# Altium schematic sheet mini_backplane.SchDoc
size A3
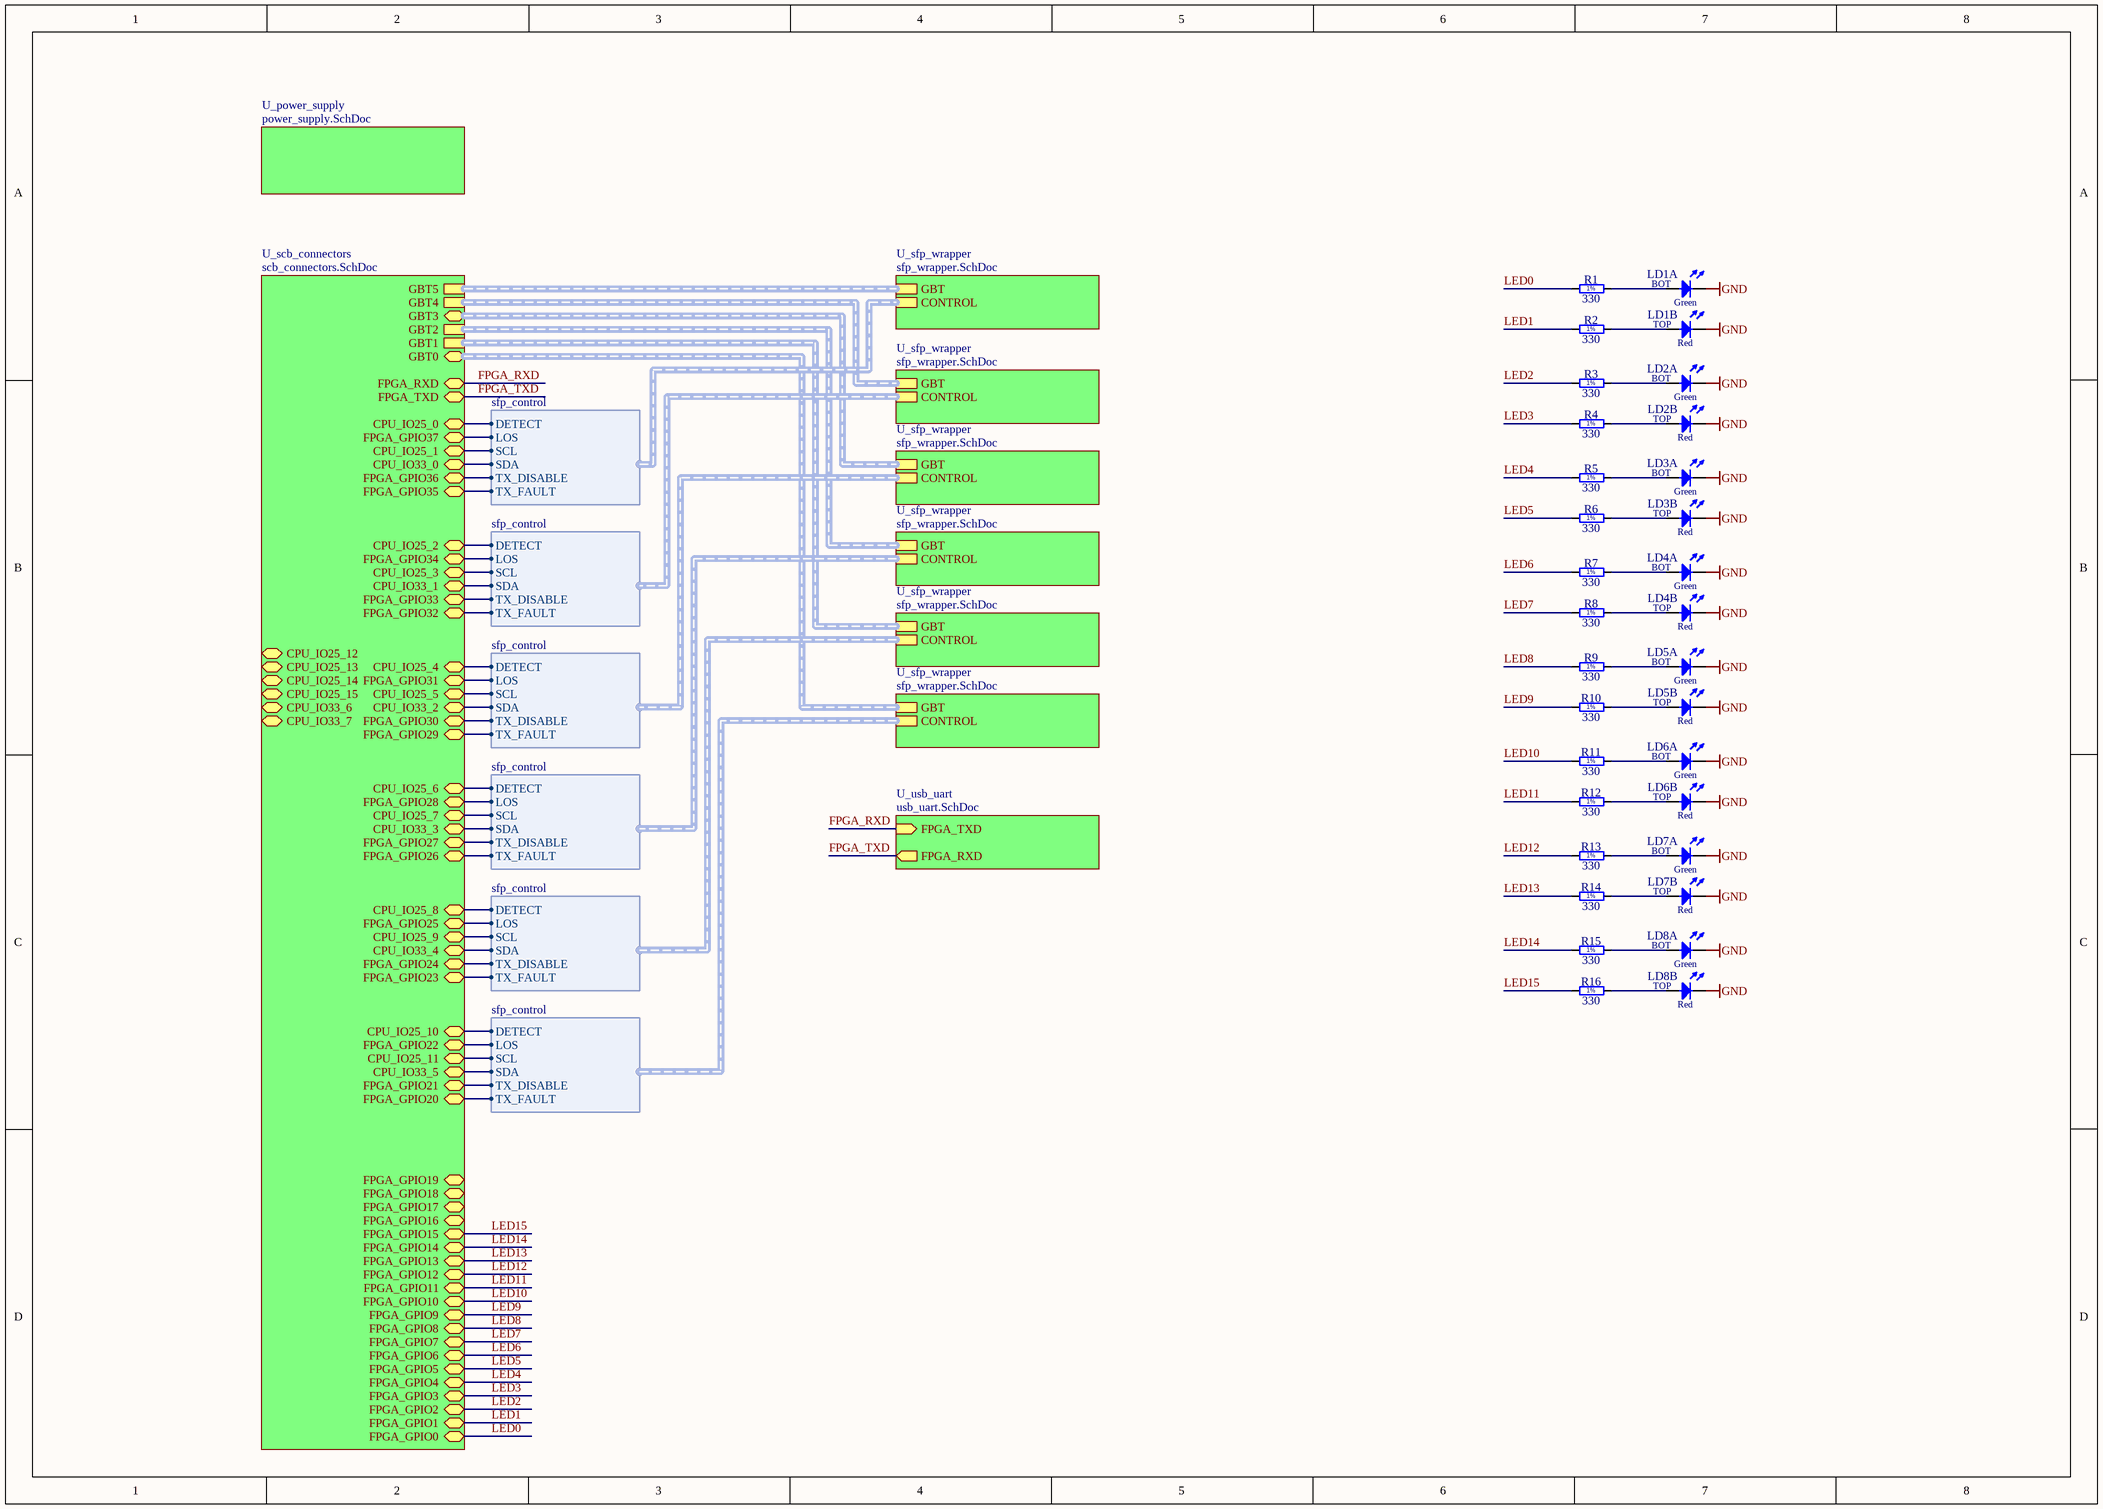
[diagram p0: mini_backplane.SchDoc]

## Parts
LD1  Red/Green  [LED_DIALIGHT_571-0112-100F]  (value not drawn)  (parts A,B of 2)
LD2  Red/Green  [LED_DIALIGHT_571-0112-100F]  (value not drawn)  (parts A,B of 2)
LD3  Red/Green  [LED_DIALIGHT_571-0112-100F]  (value not drawn)  (parts A,B of 2)
LD4  Red/Green  [LED_DIALIGHT_571-0112-100F]  (value not drawn)  (parts A,B of 2)
LD5  Red/Green  [LED_DIALIGHT_571-0112-100F]  (value not drawn)  (parts A,B of 2)
LD6  Red/Green  [LED_DIALIGHT_571-0112-100F]  (value not drawn)  (parts A,B of 2)
LD7  Red/Green  [LED_DIALIGHT_571-0112-100F]  (value not drawn)  (parts A,B of 2)
LD8  Red/Green  [LED_DIALIGHT_571-0112-100F]  (value not drawn)  (parts A,B of 2)
R1  330  [RESC1608X55N]
R2  330  [RESC1608X55N]
R3  330  [RESC1608X55N]
R4  330  [RESC1608X55N]
R5  330  [RESC1608X55N]
R6  330  [RESC1608X55N]
R7  330  [RESC1608X55N]
R8  330  [RESC1608X55N]
R9  330  [RESC1608X55N]
R10  330  [RESC1608X55N]
R11  330  [RESC1608X55N]
R12  330  [RESC1608X55N]
R13  330  [RESC1608X55N]
R14  330  [RESC1608X55N]
R15  330  [RESC1608X55N]
R16  330  [RESC1608X55N]

## Sub-sheets
U_power_supply = power_supply.SchDoc: no entries
U_scb_connectors = scb_connectors.SchDoc: FPGA_GPIO0 (bidir), FPGA_GPIO1 (bidir), FPGA_GPIO2 (bidir), FPGA_GPIO3 (bidir), FPGA_GPIO4 (bidir), FPGA_GPIO5 (bidir), FPGA_GPIO6 (bidir), FPGA_GPIO7 (bidir), FPGA_GPIO8 (bidir), FPGA_GPIO9 (bidir), FPGA_GPIO10 (bidir), FPGA_GPIO11 (bidir), FPGA_GPIO12 (bidir), FPGA_GPIO13 (bidir), FPGA_GPIO14 (bidir), FPGA_GPIO15 (bidir), FPGA_GPIO16 (bidir), FPGA_GPIO17 (bidir), FPGA_GPIO18 (bidir), FPGA_GPIO19 (bidir), FPGA_GPIO20 (bidir), FPGA_GPIO21 (bidir), FPGA_GPIO22 (bidir), FPGA_GPIO23 (bidir), FPGA_GPIO24 (bidir), FPGA_GPIO25 (bidir), FPGA_GPIO26 (bidir), FPGA_GPIO27 (bidir), FPGA_GPIO28 (bidir), FPGA_GPIO29 (bidir), FPGA_GPIO30 (bidir), FPGA_GPIO31 (bidir), FPGA_GPIO32 (bidir), FPGA_GPIO33 (bidir), FPGA_GPIO34 (bidir), FPGA_GPIO35 (bidir), FPGA_GPIO36 (bidir), FPGA_GPIO37 (bidir), GBT1 (harness sfp_gbit), GBT2 (harness sfp_gbit), GBT4 (harness sfp_gbit), GBT5 (harness sfp_gbit), FPGA_RXD (bidir), FPGA_TXD (bidir), GBT0 (harness sfp_gbit), GBT3 (harness sfp_gbit), CPU_IO25_0 (bidir), CPU_IO25_1 (bidir), CPU_IO25_2 (bidir), CPU_IO25_3 (bidir), CPU_IO25_4 (bidir), CPU_IO25_5 (bidir), CPU_IO25_6 (bidir), CPU_IO25_7 (bidir), CPU_IO25_8 (bidir), CPU_IO25_9 (bidir), CPU_IO25_10 (bidir), CPU_IO25_11 (bidir), CPU_IO25_12 (bidir), CPU_IO25_13 (bidir), CPU_IO25_14 (bidir), CPU_IO25_15 (bidir), CPU_IO33_0 (bidir), CPU_IO33_1 (bidir), CPU_IO33_2 (bidir), CPU_IO33_3 (bidir), CPU_IO33_4 (bidir), CPU_IO33_5 (bidir), CPU_IO33_6 (bidir), CPU_IO33_7 (bidir)
U_sfp_wrapper = sfp_wrapper.SchDoc: GBT (harness sfp_gbit), CONTROL (harness sfp_control)
U_sfp_wrapper = sfp_wrapper.SchDoc: GBT (harness sfp_gbit), CONTROL (harness sfp_control)
U_sfp_wrapper = sfp_wrapper.SchDoc: GBT (harness sfp_gbit), CONTROL (harness sfp_control)
U_sfp_wrapper = sfp_wrapper.SchDoc: GBT (harness sfp_gbit), CONTROL (harness sfp_control)
U_sfp_wrapper = sfp_wrapper.SchDoc: GBT (harness sfp_gbit), CONTROL (harness sfp_control)
U_sfp_wrapper = sfp_wrapper.SchDoc: GBT (harness sfp_gbit), CONTROL (harness sfp_control)
U_usb_uart = usb_uart.SchDoc: FPGA_RXD (out), FPGA_TXD (in)

## Harnesses
sfp_control: DETECT, LOS, SCL, SDA, TX_DISABLE, TX_FAULT

## Nets
GND: LD1.1(C) LD1.3(C) LD2.1(C) LD2.3(C) LD3.1(C) LD3.3(C) LD4.1(C) LD4.3(C) LD5.1(C) LD5.3(C) LD6.1(C) LD6.3(C) LD7.1(C) LD7.3(C) LD8.1(C) LD8.3(C)
FPGA_RXD: sheet U_scb_connectors/FPGA_RXD, sheet U_usb_uart/FPGA_TXD
FPGA_TXD: sheet U_scb_connectors/FPGA_TXD, sheet U_usb_uart/FPGA_RXD
LED0: R1.1 ; sheet U_scb_connectors/FPGA_GPIO0
LED1: R2.1 ; sheet U_scb_connectors/FPGA_GPIO1
LED2: R3.1 ; sheet U_scb_connectors/FPGA_GPIO2
LED3: R4.1 ; sheet U_scb_connectors/FPGA_GPIO3
LED4: R5.1 ; sheet U_scb_connectors/FPGA_GPIO4
LED5: R6.1 ; sheet U_scb_connectors/FPGA_GPIO5
LED6: R7.1 ; sheet U_scb_connectors/FPGA_GPIO6
LED7: R8.1 ; sheet U_scb_connectors/FPGA_GPIO7
LED8: R9.1 ; sheet U_scb_connectors/FPGA_GPIO8
LED9: R10.1 ; sheet U_scb_connectors/FPGA_GPIO9
LED10: R11.1 ; sheet U_scb_connectors/FPGA_GPIO10
LED11: R12.1 ; sheet U_scb_connectors/FPGA_GPIO11
LED12: R13.1 ; sheet U_scb_connectors/FPGA_GPIO12
LED13: R14.1 ; sheet U_scb_connectors/FPGA_GPIO13
LED14: R15.1 ; sheet U_scb_connectors/FPGA_GPIO14
LED15: R16.1 ; sheet U_scb_connectors/FPGA_GPIO15
NetLD1_2: LD1.2(A) R1.2
NetLD1_4: LD1.4(A) R2.2
NetLD2_2: LD2.2(A) R3.2
NetLD2_4: LD2.4(A) R4.2
NetLD3_2: LD3.2(A) R5.2
NetLD3_4: LD3.4(A) R6.2
NetLD4_2: LD4.2(A) R7.2
NetLD4_4: LD4.4(A) R8.2
NetLD5_2: LD5.2(A) R9.2
NetLD5_4: LD5.4(A) R10.2
NetLD6_2: LD6.2(A) R11.2
NetLD6_4: LD6.4(A) R12.2
NetLD7_2: LD7.2(A) R13.2
NetLD7_4: LD7.4(A) R14.2
NetLD8_2: LD8.2(A) R15.2
NetLD8_4: LD8.4(A) R16.2
(unnamed): sheet U_scb_connectors/FPGA_GPIO20, sheet U_sfp_wrapper/CONTROL.TX_FAULT
(unnamed): sheet U_scb_connectors/FPGA_GPIO21, sheet U_sfp_wrapper/CONTROL.TX_DISABLE
(unnamed): sheet U_scb_connectors/FPGA_GPIO22, sheet U_sfp_wrapper/CONTROL.LOS
(unnamed): sheet U_scb_connectors/FPGA_GPIO23, sheet U_sfp_wrapper/CONTROL.TX_FAULT
(unnamed): sheet U_scb_connectors/FPGA_GPIO24, sheet U_sfp_wrapper/CONTROL.TX_DISABLE
(unnamed): sheet U_scb_connectors/FPGA_GPIO25, sheet U_sfp_wrapper/CONTROL.LOS
(unnamed): sheet U_scb_connectors/FPGA_GPIO26, sheet U_sfp_wrapper/CONTROL.TX_FAULT
(unnamed): sheet U_scb_connectors/FPGA_GPIO27, sheet U_sfp_wrapper/CONTROL.TX_DISABLE
(unnamed): sheet U_scb_connectors/FPGA_GPIO28, sheet U_sfp_wrapper/CONTROL.LOS
(unnamed): sheet U_scb_connectors/FPGA_GPIO29, sheet U_sfp_wrapper/CONTROL.TX_FAULT
(unnamed): sheet U_scb_connectors/FPGA_GPIO30, sheet U_sfp_wrapper/CONTROL.TX_DISABLE
(unnamed): sheet U_scb_connectors/FPGA_GPIO31, sheet U_sfp_wrapper/CONTROL.LOS
(unnamed): sheet U_scb_connectors/FPGA_GPIO32, sheet U_sfp_wrapper/CONTROL.TX_FAULT
(unnamed): sheet U_scb_connectors/FPGA_GPIO33, sheet U_sfp_wrapper/CONTROL.TX_DISABLE
(unnamed): sheet U_scb_connectors/FPGA_GPIO34, sheet U_sfp_wrapper/CONTROL.LOS
(unnamed): sheet U_scb_connectors/FPGA_GPIO35, sheet U_sfp_wrapper/CONTROL.TX_FAULT
(unnamed): sheet U_scb_connectors/FPGA_GPIO36, sheet U_sfp_wrapper/CONTROL.TX_DISABLE
(unnamed): sheet U_scb_connectors/FPGA_GPIO37, sheet U_sfp_wrapper/CONTROL.LOS
(unnamed): sheet U_scb_connectors/CPU_IO25_0, sheet U_sfp_wrapper/CONTROL.DETECT
(unnamed): sheet U_scb_connectors/CPU_IO25_1, sheet U_sfp_wrapper/CONTROL.SCL
(unnamed): sheet U_scb_connectors/CPU_IO25_2, sheet U_sfp_wrapper/CONTROL.DETECT
(unnamed): sheet U_scb_connectors/CPU_IO25_3, sheet U_sfp_wrapper/CONTROL.SCL
(unnamed): sheet U_scb_connectors/CPU_IO25_4, sheet U_sfp_wrapper/CONTROL.DETECT
(unnamed): sheet U_scb_connectors/CPU_IO25_5, sheet U_sfp_wrapper/CONTROL.SCL
(unnamed): sheet U_scb_connectors/CPU_IO25_6, sheet U_sfp_wrapper/CONTROL.DETECT
(unnamed): sheet U_scb_connectors/CPU_IO25_7, sheet U_sfp_wrapper/CONTROL.SCL
(unnamed): sheet U_scb_connectors/CPU_IO25_8, sheet U_sfp_wrapper/CONTROL.DETECT
(unnamed): sheet U_scb_connectors/CPU_IO25_9, sheet U_sfp_wrapper/CONTROL.SCL
(unnamed): sheet U_scb_connectors/CPU_IO25_10, sheet U_sfp_wrapper/CONTROL.DETECT
(unnamed): sheet U_scb_connectors/CPU_IO25_11, sheet U_sfp_wrapper/CONTROL.SCL
(unnamed): sheet U_scb_connectors/CPU_IO33_0, sheet U_sfp_wrapper/CONTROL.SDA
(unnamed): sheet U_scb_connectors/CPU_IO33_1, sheet U_sfp_wrapper/CONTROL.SDA
(unnamed): sheet U_scb_connectors/CPU_IO33_2, sheet U_sfp_wrapper/CONTROL.SDA
(unnamed): sheet U_scb_connectors/CPU_IO33_3, sheet U_sfp_wrapper/CONTROL.SDA
(unnamed): sheet U_scb_connectors/CPU_IO33_4, sheet U_sfp_wrapper/CONTROL.SDA
(unnamed): sheet U_scb_connectors/CPU_IO33_5, sheet U_sfp_wrapper/CONTROL.SDA

## Buses and harness runs
harness sheet U_scb_connectors/GBT0 = sheet U_sfp_wrapper/GBT
harness sheet U_scb_connectors/GBT1 = sheet U_sfp_wrapper/GBT
harness sheet U_scb_connectors/GBT2 = sheet U_sfp_wrapper/GBT
harness sheet U_scb_connectors/GBT3 = sheet U_sfp_wrapper/GBT
harness sheet U_scb_connectors/GBT4 = sheet U_sfp_wrapper/GBT
harness sheet U_scb_connectors/GBT5 = sheet U_sfp_wrapper/GBT

## Notes on the sheet
- (in symbol LED_DIALIGHT_571-0112-100F, part A) BOT; Green
- (in symbol LED_DIALIGHT_571-0112-100F, part B) TOP; Red
- (in symbol R0603_330R_1%_0.1W_100PPM) 1%

## Library data of the parts
LD1-LD8 = LED_DIALIGHT_571-0112-100F: 2x LED  Botom Green, Top Red; Part Description: Dual 2mm  LEDs, Red Top,Green Bot, CBI® Circuit Board Indicator (With positioning pins); Table: LEDs & Displays; Part Number: LED_DIALIGHT_571-0112-100F; Component Kind: Standard; Component Type: Standard; Color: Red/Green; PackageDescription: 2x 2mm LED (Top: Red, Bot: Green) PCB Edge Mounting (With positioning pins) DIALIGHT 571 Serie; Manufacturer: DIALIGHT; Manufacturer Part Number: 571-0112-100F; Pin Count: 4; Mounted: Yes; Socket: No; SMD: No; ComponentHeight: 8.6mm; HelpURL: \\cern.ch\dfs\Applications\Altium\Datasheets\LED_DIALIGHT_571-0112-100F.pdf; Author: CERN DEM JLC; CreateDate: 11/5/2009; LatestRevisionDate: 3/17/2010
R1-R16 = R0603_330R_1%_0.1W_100PPM: Resistor - 1%; Part Description: General Purpose Thick Film Chip Resistor; Manufacturer: GENERIC; Manufacturer1 Part Number: NRC06F3300TRF; Power: 0.1W; TC: ±100ppm/°C; Table: Resistors SMD; Part Number: R0603_330R_1%_0.1W_100PPM; Component Kind: Standard; Component Type: Standard; Pin Count: 2; Value: 330; Status: Preferred; Tolerance: ±1%; Manufacturer Part Number: R0603_330R_1%_0.1W_100PPM; Case: 0603; Mounted: Yes; Socket: No; SMD: Yes; Manufacturer1 Example: NIC COMPONENT; Manufacturer1 ComponentHeight: 0.55mm; HelpURL: \\cern.ch\dfs\Applications\Altium\Datasheets\R0603_NIC_NRC.pdf; Author: CERN DEM JLC; CreateDate: 12/3/2007; LatestRevisionDate: 3/13/2008